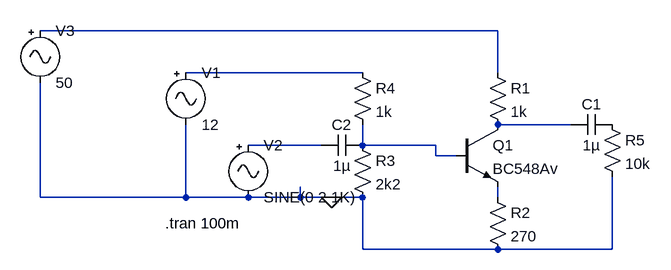
[diagram p0: schematic AmplificadosAudioBC548.asc]
AmplificadosAudioBC548.asc, the LTspice schematic file:
Version 4
SHEET 1 880 680
WIRE 416 0 -288 0
WIRE 208 64 -64 64
WIRE 416 64 416 0
WIRE 528 144 416 144
WIRE 144 176 32 176
WIRE 208 176 208 144
WIRE 320 176 208 176
WIRE 320 192 320 176
WIRE 352 192 320 192
WIRE -288 256 -288 80
WIRE -64 256 -64 144
WIRE -64 256 -288 256
WIRE 32 256 -64 256
WIRE 112 256 112 240
WIRE 112 256 32 256
WIRE 160 256 112 256
WIRE 208 256 160 256
WIRE 416 256 416 240
WIRE 208 336 208 256
WIRE 416 336 208 336
WIRE 592 336 592 224
WIRE 592 336 416 336
FLAG 160 256 0
SYMBOL npn 352 144 R0
SYMATTR InstName Q1
SYMATTR Value BC548Av
SYMBOL res 400 48 R0
SYMATTR InstName R1
SYMATTR Value 1k
SYMBOL res 400 240 R0
SYMATTR InstName R2
SYMATTR Value 270
SYMBOL res 192 160 R0
SYMATTR InstName R3
SYMATTR Value 2k2
SYMBOL res 192 48 R0
SYMATTR InstName R4
SYMATTR Value 1k
SYMBOL cap 528 160 R270
WINDOW 0 32 32 VTop 2
WINDOW 3 0 32 VBottom 2
SYMATTR InstName C1
SYMATTR Value 1µ
SYMBOL cap 144 192 R270
WINDOW 0 32 32 VTop 2
WINDOW 3 0 32 VBottom 2
SYMATTR InstName C2
SYMATTR Value 1µ
SYMBOL Misc\\signal -64 48 R0
WINDOW 123 0 0 Left 2
WINDOW 39 0 0 Left 2
SYMATTR InstName V1
SYMATTR Value 12
SYMBOL Misc\\signal 32 160 R0
WINDOW 123 0 0 Left 2
WINDOW 39 0 0 Left 2
SYMATTR InstName V2
SYMATTR Value SINE(0 2 1K)
SYMBOL Misc\\signal -288 -16 R0
WINDOW 123 0 0 Left 2
WINDOW 39 0 0 Left 2
SYMATTR InstName V3
SYMATTR Value 50
SYMBOL res 576 128 R0
SYMATTR InstName R5
SYMATTR Value 10k
TEXT -96 296 Left 2 !.tran 100m

The netlist it stands for:
* AmplificadosAudioBC548.asc
Q1 N003 N005 N006 0 BC548Av
R1 N001 N003 1k
R2 N006 0 270
R3 N005 0 2k2
R4 N002 N005 1k
C1 N003 P001 1µ
C2 N004 N005 1µ
V1 N002 0 12
V2 N004 0 SINE(0 2 1K)
V3 N001 0 50
R5 P001 0 10k
.model NPN NPN
.model PNP PNP
.lib standard.bjt
.tran 100m
.backanno
.end